# Altium schematic sheet 5v schematic.SchDoc
size 228 x 152 mm; SheetNumber: 1; SheetTotal: 1
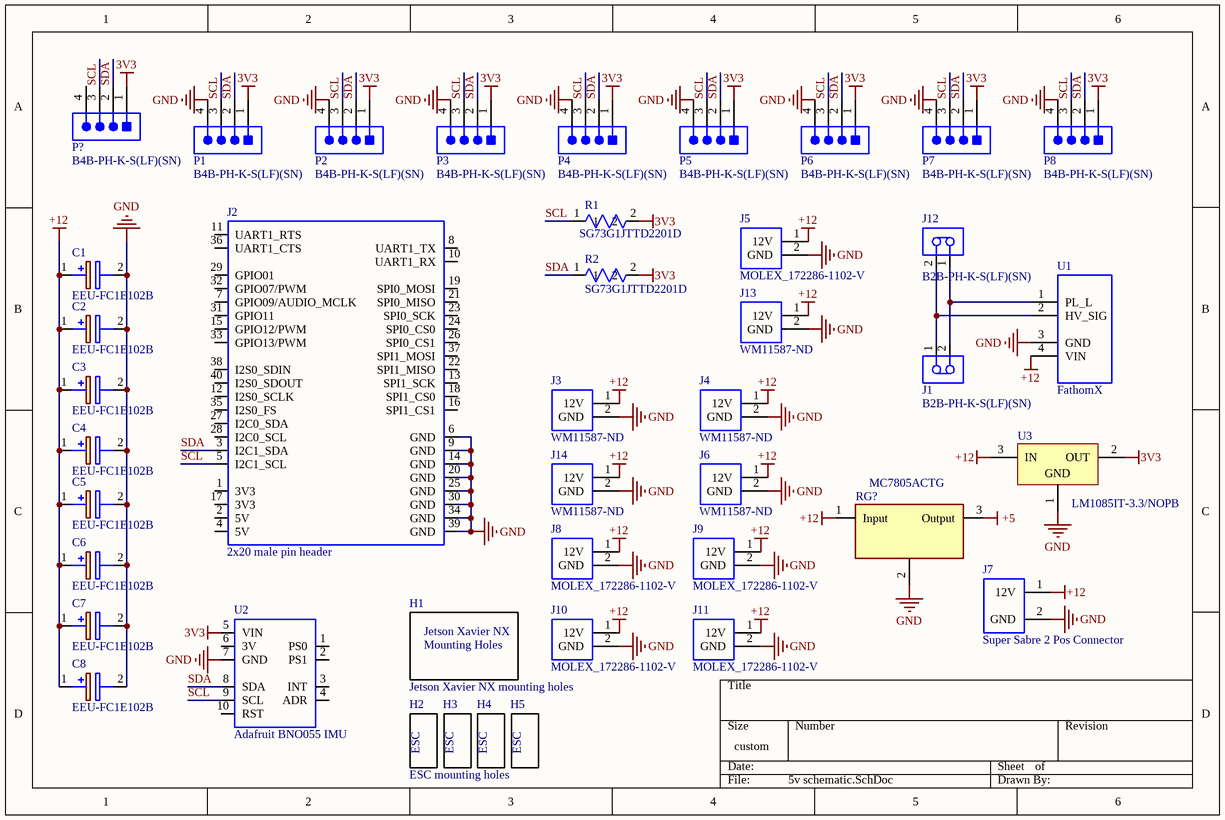
[diagram p0: 5v schematic.SchDoc]

## Parts
C1  EEU-FC1E102B  [EEU-FC1E102B]
C2  EEU-FC1E102B  [EEU-FC1E102B]
C3  EEU-FC1E102B  [EEU-FC1E102B]
C4  EEU-FC1E102B  [EEU-FC1E102B]
C5  EEU-FC1E102B  [EEU-FC1E102B]
C6  EEU-FC1E102B  [EEU-FC1E102B]
C7  EEU-FC1E102B  [EEU-FC1E102B]
C8  EEU-FC1E102B  [EEU-FC1E102B]
H1  Jetson Xavier NX mounting holes  [Jetson mounting holes]  (no BOM)
H2  ESC mounting holes  [Jonathon ESC mounting holes]  (no BOM)
H3  ESC mounting holes  [Jonathon ESC mounting holes]  (value not drawn)  (no BOM)
H4  ESC mounting holes  [Jonathon ESC mounting holes]  (value not drawn)  (no BOM)
H5  ESC mounting holes  [Jonathon ESC mounting holes]  (value not drawn)  (no BOM)
J1  B2B-PH-K-S(LF)(SN)  [JST-B2B-PH-K-S_V]
J2  2x20 male pin header  [2x20 pin header]
J3  Supplier Part Number 1: WM11587-ND  [2CONTAC_ULTRAFIT_R/A]  (hidden comment: MOLEX_172310-1202-R/A)
J4  Supplier Part Number 1: WM11587-ND  [2CONTAC_ULTRAFIT_R/A]  (hidden comment: MOLEX_172310-1202-R/A)
J5  MOLEX_172286-1102-V  [Molex_172286-1102_0]
J6  Supplier Part Number 1: WM11587-ND  [2CONTAC_ULTRAFIT_R/A]  (hidden comment: MOLEX_172310-1202-R/A)
J7  Super Sabre 2 Pos Connector  [172043-0202]
J8  MOLEX_172286-1102-V  [Molex_172286-1102_0]
J9  MOLEX_172286-1102-V  [Molex_172286-1102_0]
J10  MOLEX_172286-1102-V  [Molex_172286-1102_0]
J11  MOLEX_172286-1102-V  [Molex_172286-1102_0]
J12  B2B-PH-K-S(LF)(SN)  [JST-B2B-PH-K-S_V]
J13  Supplier Part Number 1: WM11587-ND  [2CONTAC_ULTRAFIT_R/A]  (hidden comment: MOLEX_172310-1202-R/A)
J14  Supplier Part Number 1: WM11587-ND  [2CONTAC_ULTRAFIT_R/A]  (hidden comment: MOLEX_172310-1202-R/A)
P1  B4B-PH-K-S(LF)(SN)  [JST-B4B-PH-K-S_V]
P2  B4B-PH-K-S(LF)(SN)  [JST-B4B-PH-K-S_V]
P3  B4B-PH-K-S(LF)(SN)  [JST-B4B-PH-K-S_V]
P4  B4B-PH-K-S(LF)(SN)  [JST-B4B-PH-K-S_V]
P5  B4B-PH-K-S(LF)(SN)  [JST-B4B-PH-K-S_V]
P6  B4B-PH-K-S(LF)(SN)  [JST-B4B-PH-K-S_V]
P7  B4B-PH-K-S(LF)(SN)  [JST-B4B-PH-K-S_V]
P8  B4B-PH-K-S(LF)(SN)  [JST-B4B-PH-K-S_V]
P?  B4B-PH-K-S(LF)(SN)  [JST-B4B-PH-K-S_V]
R1  SG73G1JTTD2201D  [SG73G1JTTD2201D]
R2  SG73G1JTTD2201D  [SG73G1JTTD2201D]
RG?  Part Number: MC7805ACTG  [ON_Semi_221AB_0]  (hidden comment: Reg_ON_Semi_MC7805ACTG_eec)
U1  FathomX  [FATHOM-X]  (no BOM)
U2  Adafruit BNO055 IMU  [Adafruit BNO055 IMU]
U3  LM1085IT-3.3/NOPB  [NDE0003A]

## Nets
3V3: P1.1 P2.1 P3.1 P4.1 P5.1 P6.1 P7.1 P8.1 P?.1 R1.2 R2.2 U2.5(VIN) U3.2(OUT)
+12: C1.1(+) C2.1(+) C3.1(+) C4.1(+) C5.1(+) C6.1(+) C7.1(+) C8.1(+) J3.1(12V) J4.1(12V) J5.1(12V) J6.1(12V) J7.1(12V) J8.1(12V) J9.1(12V) J10.1(12V) J11.1(12V) J13.1(12V) J14.1(12V) U1.4(VIN) U3.3(IN)
GND: C1.2(-) C2.2(-) C3.2(-) C4.2(-) C5.2(-) C6.2(-) C7.2(-) C8.2(-) J2.6(GND) J2.9(GND) J2.14(GND) J2.20(GND) J2.25(GND) J2.30(GND) J2.34(GND) J2.39(GND) J3.2(GND) J4.2(GND) J5.2(GND) J6.2(GND) J7.2(GND) J8.2(GND) J9.2(GND) J10.2(GND) J11.2(GND) J13.2(GND) J14.2(GND) P1.4 P2.4 P3.4 P4.4 P5.4 P6.4 P7.4 P8.4 RG?.2(Ground) U1.3(GND) U2.7(GND) U3.1(GND)
SCL: J2.5(I2C1_SCL) P1.3 P2.3 P3.3 P4.3 P5.3 P6.3 P7.3 P8.3 P?.3 R1.1 U2.9(SCL)
SDA: J2.3(I2C1_SDA) P1.2 P2.2 P3.2 P4.2 P5.2 P6.2 P7.2 P8.2 P?.2 R2.1 U2.8(SDA)
NetJ1_1: J1.1 J12.2 U1.2(HV_SIG)
NetJ1_2: J1.2 J12.1 U1.1(PL_L)

Not connected (* = marked no-connect by the designer): J2 1(3V3) 2(5V) 4(5V) 7(GPIO09/AUDIO_MCLK) 8(UART1_TX) 10(UART1_RX) 11(UART1_RTS) 12(I2S0_SCLK) 13(SPI1_SCK) 15(GPIO12/PWM) 16(SPI1_CS1) 17(3V3) 18(SPI1_CS0) 19(SPI0_MOSI) 21(SPI0_MISO) 22(SPI1_MISO) 23(SPI0_SCK) 24(SPI0_CS0) 26(SPI0_CS1) 27(I2C0_SDA) 28(I2C0_SCL) 29(GPIO01) 31(GPIO11) 32(GPIO07/PWM) 33(GPIO13/PWM) 35(I2S0_FS) 36(UART1_CTS) 37(SPI1_MOSI) 38(I2S0_SDIN) 40(I2S0_SDOUT); P? 4; RG? 1(Input) 3(Output); U2 1(PS0) 2(PS1) 3(INT) 4(ADR) 6(3V) 10(RST)

## Notes on the sheet
- Labels drawn without touching a wire or pin:  +5, +12
- (in symbol ESC mounting holes) ESC
- (in symbol Jetson Xavier NX mounting holes) Jetson Xavier NX; Mounting Holes

## Library data of the parts
J1 J12 = CMP-2000-05162-1: Male Header, Pitch 2 mm, 1 x 2 Position, Height 6 mm, Tail Length 3.4 mm, -25 to 85 degC, RoHS, Bulk; Manufacturer: JST; Pitch: 2mm; Style/Orientation: StraightHeader/Plug; No of Positions: 2; Datasheet Version: Nov-08; Datasheet URL: http://datasheet.octopart.com/B2B-PH-K-S%28LF%29%28SN%29-JST-datasheet-8324864.pdf; Manufacturer URL: http://www.jst.com/home2.html; Type: ShroudedHeader; Termination: Crimp
J3 J4 J6 J13 J14 = MOLEX_172310-1202-R/A: 172310-1202. - CONNECTOR, HDR, 2POS, 1ROW, 3.5MM, R/A; Manufacturer: Molex; Number of Positions: 2; Gender: Male; Connector Type: Male Pin; Pitch: 0.138inch; Supplier 1: Digi-Key; Manufacturer Part Number: 172310-1202; RoHS: Yes; Category: Headers and Wire Housings; Stock 1: 2743; Pricing 1: 1=1.43000, 10=1.22000, 175=1.00749, 1050=0.79537, 4900=0.70523, 10150=0.68933 (USD); Mount: Through Hole; Number of Pins: 2; Contact Plating: Gold; Color: Black; Contact Material: Copper Alloy; Packaging: Tray; Number of Rows: 1; Termination: Solder; Fastening Type: Latch; Number of Circuits: 2; Number of Contacts: 2; REACH SVHC: Unknown; RoHS Compliant: Yes; ComponentLink1URL: http://www.farnell.com/datasheets/2215923.pdf?src-supplier=Farnell; ComponentLink1Description: http://www.farnell.com/datasheets/2215923.pdf?src-supplier=Farnell; ComponentLink2URL: http://www.alliedelec.com/images/products/datasheets/bm/MOLEX/70617677.pdf?src-supplier=Allied+Electronics; ComponentLink2Description: http://www.alliedelec.com/images/products/datasheets/bm/MOLEX/70617677.pdf?src-supplier=Allied+Electronics; ComponentLink3URL: https://www.molex.com/pdm_docs/sd/1723101202_sd.pdf?src-supplier=Digi-Key; ComponentLink3Description: https://www.molex.com/pdm_docs/sd/1723101202_sd.pdf?src-supplier=Digi-Key; ComponentLink4URL: http://www.farnell.com/datasheets/1955765.pdf?src-supplier=Element14; ComponentLink4Description: http://www.farnell.com/datasheets/1955765.pdf?src-supplier=Element14; ComponentLink5URL: http://www.farnell.com/datasheets/1944206.pdf?src-supplier=Element14; ComponentLink5Description: http://www.farnell.com/datasheets/1944206.pdf?src-supplier=Element14; ComponentLink6URL: http://www.farnell.com/datasheets/2215923.pdf?src-supplier=Newark; ComponentLink6Description: http://www.farnell.com/datasheets/2215923.pdf?src-supplier=Newark
J5 J8-J11 = MOLEX_172286-1102-V: 172286-1102, CONNECTOR, HEADER, 2POS, 1ROW, 3.5MM; Manufacturer: Molex; Number of Positions: 2; Current Rating: 14A; Voltage Rating: 400V; Gender: Male; Connector Type: Male Pin; Pitch: 0.138inch; Supplier 1: Digi-Key; Manufacturer Part Number: 172286-1102; RoHS: Yes; Category: Headers and Wire Housings; Stock 1: 6743; Pricing 1: 1=0.73000, 10=0.61800, 440=0.48105, 2450=0.34360, 4900=0.33215, 12250=0.30466 (USD); Mount: Through Hole; Number of Pins: 2; Contact Plating: Tin; Color: Black; Contact Material: Copper Alloy; Packaging: Tray; Number of Rows: 1; Termination: Solder; Fastening Type: Latch; Number of Contacts: 2; Number of Circuits: 2; Orientation: Vertical; REACH SVHC: Unknown; RoHS Compliant: Yes; ComponentLink1URL: http://www.mouser.com/ds/2/276/1722861102_PCB_HEADERS-704547.pdf?src-supplier=Mouser; ComponentLink1Description: http://www.mouser.com/ds/2/276/1722861102_PCB_HEADERS-704547.pdf?src-supplier=Mouser; ComponentLink2URL: http://www.farnell.com/datasheets/2214269.pdf?src-supplier=Farnell; ComponentLink2Description: http://www.farnell.com/datasheets/2214269.pdf?src-supplier=Farnell; ComponentLink3URL: http://www.alliedelec.com/images/products/datasheets/bm/MOLEX/70617660.pdf?src-supplier=Allied+Electronics; ComponentLink3Description: http://www.alliedelec.com/images/products/datasheets/bm/MOLEX/70617660.pdf?src-supplier=Allied+Electronics; ComponentLink4URL: https://www.molex.com/pdm_docs/sd/1722861102_sd.pdf?src-supplier=Digi-Key; ComponentLink4Description: https://www.molex.com/pdm_docs/sd/1722861102_sd.pdf?src-supplier=Digi-Key; ComponentLink5URL: http://www.farnell.com/datasheets/2214269.pdf?src-supplier=Newark; ComponentLink5Description: http://www.farnell.com/datasheets/2214269.pdf?src-supplier=Newark; ComponentLink6URL: http://www.farnell.com/datasheets/1955765.pdf?src-supplier=Element14; ComponentLink6Description: http://www.farnell.com/datasheets/1955765.pdf?src-supplier=Element14; ComponentLink7URL: http://www.farnell.com/datasheets/1944206.pdf?src-supplier=Element14; ComponentLink7Description: http://www.farnell.com/datasheets/1944206.pdf?src-supplier=Element14
P1-P8 P? = CMP-2000-05165-1: Male Header, Pitch 2 mm, 1 x 4 Position, Height 6 mm, Tail Length 3.4 mm, -25 to 85 degC, RoHS, Bulk; Manufacturer: JST; No of Positions: 4; Style/Orientation: StraightHeader/Plug; Pitch: 2mm; Datasheet URL: http://datasheet.octopart.com/B4B-PH-K-S%28LF%29%28SN%29-JST-datasheet-10558886.pdf; Type: ShroudedHeader; Manufacturer URL: http://www.jst.com/home2.html; Termination: Crimp; Datasheet Version: Apr-09
R1 R2 = SG73G1JTTD2201D: Res Thick Film 0603 2.2K Ohm 0.5% 0.33W(1/3W) ±50ppm/°C Pad SMD Automotive T/R; Manufacturer: KOA Speer; Supplier 1: Arrow Electronics; Manufacturer Part Number: SG73G1JTTD2201D; RoHS: Yes; Stock 1: 4818; Pricing 1: 1=0.06970, 10=0.06900, 25=0.05370, 50=0.05320, 100=0.04410, 250=0.04340, 500=0.04260, 1000=0.04170, 3000=0.04110 (USD); RoHS Compliant: Yes; Supplier Part Number 1: SG73G1JTTD2201D
RG? = Reg_ON_Semi_MC7805ACTG_eec: REG IC REG LDO 5V 1A TO220AB; Manufacturer: ON Semi; Voltage - Dropout (Typical): 2V @ 1A; Voltage - Input: Up to 35V; Mfg Package Ident: 221AB; Regulator Topology: Positive Fixed; helpURL: https://upverter.com/upn/revision/ddcd03ab3a09e85f/; ComponentLink2Description: Datasheet; Temperature: 0°C to +125°C; Package: 221AB; Supplier 2: Mouser; Price: 0.328005676572; Supplier 1: Digi-Key; ComponentLink1URL: https://upverter.com/upn/revision/ddcd03ab3a09e85f/; Supplier Part Number 2: 863-MC7805ACTG; Supplier Part Number 1: MC7805ACTGOS-ND; Voltage: 5V; ComponentLink1Description: Upverter; ComponentLink2URL: http://www.onsemi.com/pub_link/Collateral/MC7800-D.PDF; RoHS: TRUE; Mouser Part Number: 863-MC7805ACTG; Ipc Land Pattern Name: TO-220; Temperature Range High: +125°C; Digikey Description: REG IC REG LDO 5V 1A TO220AB; Digikey Part Number: MC7805ACTGOS-ND; Lead Free: yes; Temperature Range Low: 0°C; Voltage - Output: 5V
U3 = CMP-0062-02540-3: 3A Low Dropout Positive Regulators, 3-pin TO-220, Pb-Free; Manufacturer: Texas Instruments; PackageTopMarking: NSUZXYTTE#*LM1085*IT-3.3; PowerWise: N; CompType: LDO IC; ComponentLink1Description: Datasheet URL; PinCount: 3; ComponentLink1URL: http://www.ti.com/general/docs/lit/getliterature.tsp?genericPartNumber=LM1085&fileType=pdf; PackageReference: NDE0003A; PackageDescription: TO-220, Molded, 3 Lead, Straight; RoHS: Y